# Altium schematic sheet PowerSupplies.SchDoc
size A4; SheetNumber: 5; SheetTotal: 22
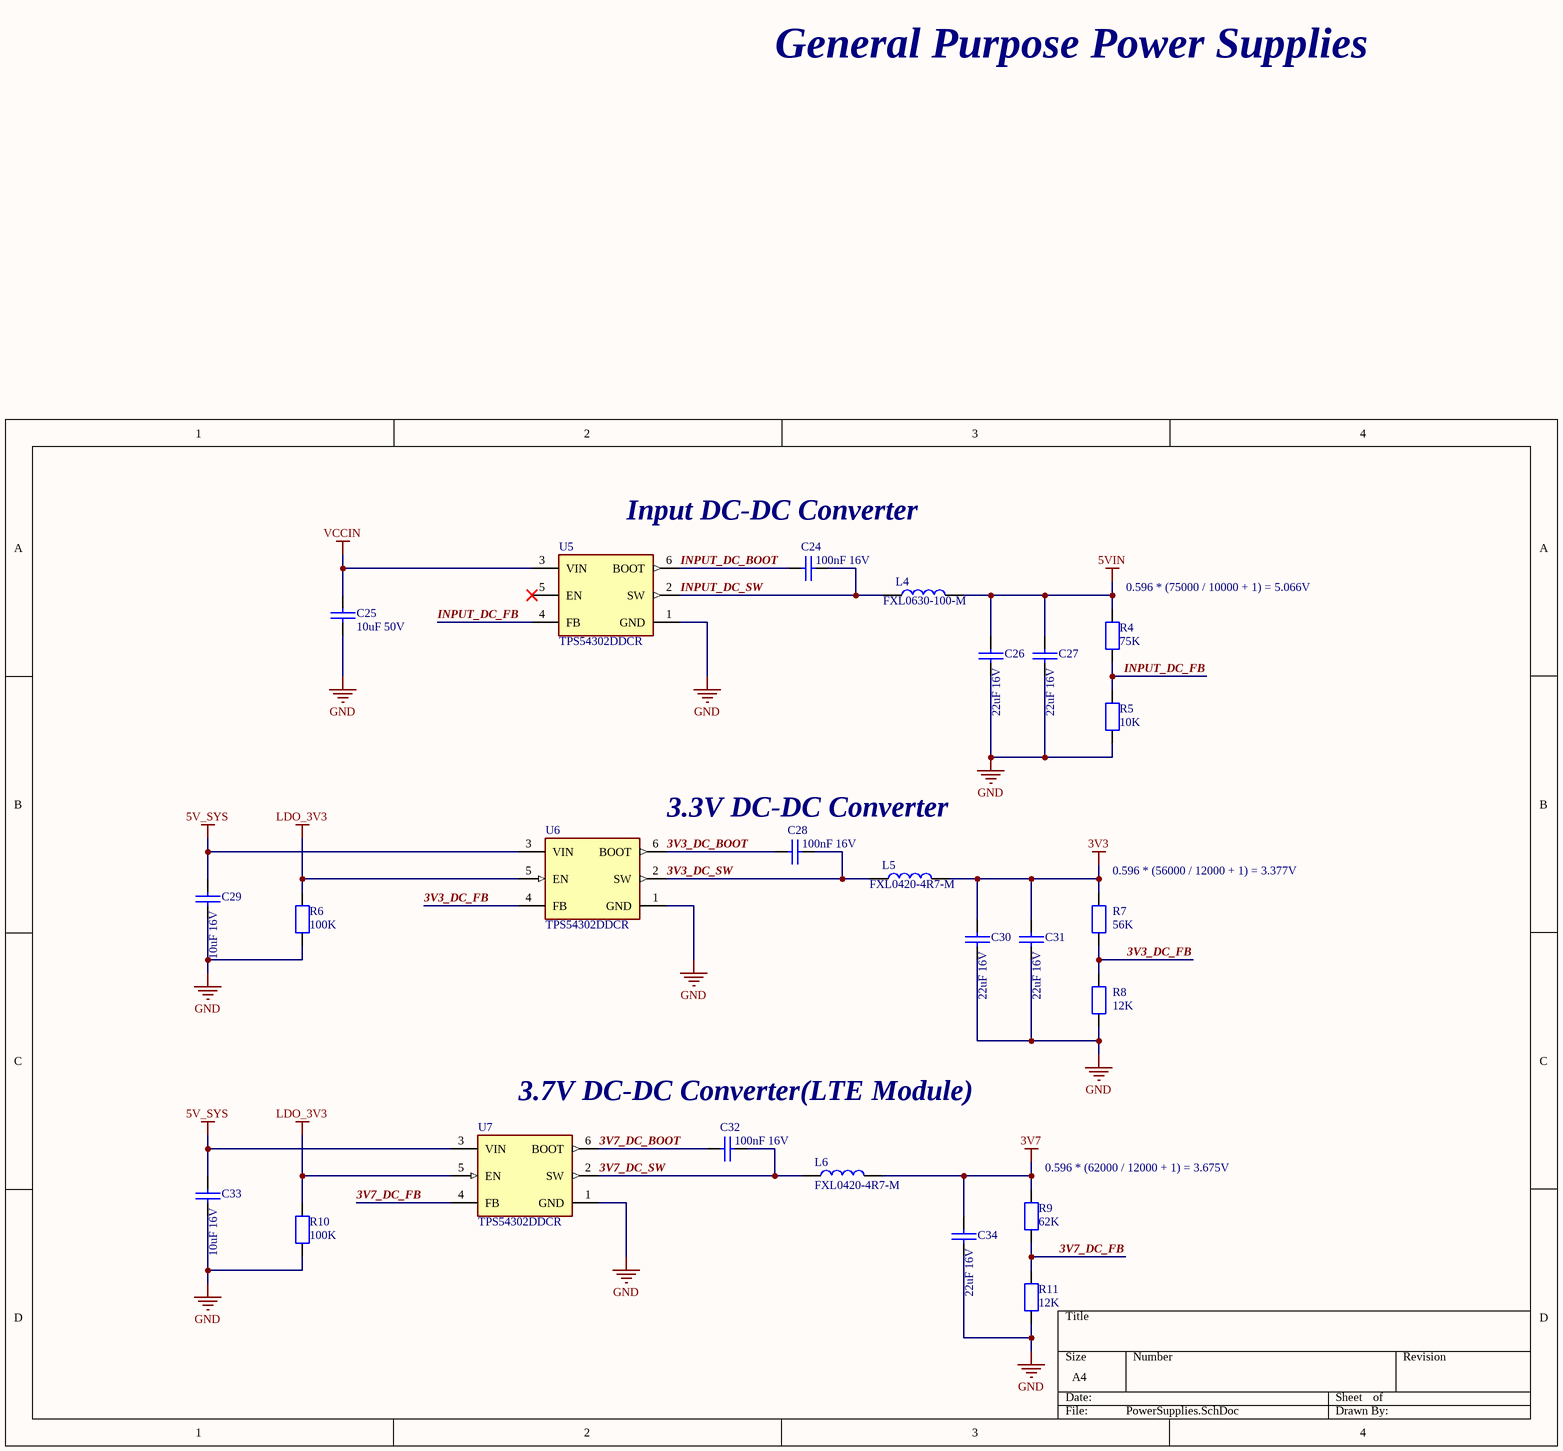
[diagram p0: PowerSupplies.SchDoc]

## Parts
C24  100nF 16V  [C_0402]
C25  10uF 50V  [C_1206]
C26  22uF 16V  [C_0603]
C27  22uF 16V  [C_0603]
C28  100nF 16V  [C_0402]
C29  10uF 16V  [C_0603]
C30  22uF 16V  [C_0603]
C31  22uF 16V  [C_0603]
C32  100nF 16V  [C_0402]
C33  10uF 16V  [C_0603]
C34  22uF 16V  [C_0603]
L4  FXL0630-100-M  [FXL0630]
L5  FXL0420-4R7-M  [FXL0420]
L6  FXL0420-4R7-M  [FXL0420]
R4  75K  [R_0603]
R5  10K  [R_0603]
R6  100K  [R_0603]
R7  56K  [R_0603]
R8  12K  [R_0603]
R9  62K  [R_0603]
R10  100K  [R_0603]
R11  12K  [R_0603]
U5  TPS54302DDCR  [FP-DDC0006A-MFG]
U6  TPS54302DDCR  [FP-DDC0006A-MFG]
U7  TPS54302DDCR  [FP-DDC0006A-MFG]

## Nets
3V3: C30.1 C31.1 L5.2 R7.2
3V7: C34.1 L6.2 R9.2
5V_SYS: C29.1 C33.1 U6.3(VIN) U7.3(VIN)
5VIN: C26.1 C27.1 L4.2 R4.2
GND: C25.2 C26.2 C27.2 C29.2 C30.2 C31.2 C33.2 C34.2 R5.1 R6.1 R8.1 R10.1 R11.1 U5.1(GND) U6.1(GND) U7.1(GND)
LDO_3V3: R6.2 R10.2 U6.5(EN) U7.5(EN)
VCCIN: C25.1 U5.3(VIN)
3V3_DC_BOOT: C28.1 U6.6(BOOT)
3V3_DC_FB: R7.1 R8.2 U6.4(FB)
3V3_DC_SW: C28.2 L5.1 U6.2(SW)
3V7_DC_BOOT: C32.1 U7.6(BOOT)
3V7_DC_FB: R9.1 R11.2 U7.4(FB)
3V7_DC_SW: C32.2 L6.1 U7.2(SW)
INPUT_DC_BOOT: C24.1 U5.6(BOOT)
INPUT_DC_FB: R4.1 R5.2 U5.4(FB)
INPUT_DC_SW: C24.2 L4.1 U5.2(SW)

Not connected (* = marked no-connect by the designer): U5 5(EN)*

## Notes on the sheet
- General Purpose Power Supplies
- Input DC-DC Converter
- (near R4) 0.596 * (75000 / 10000 + 1) = 5.066V
- 3.3V DC-DC Converter
- (near R7) 0.596 * (56000 / 12000 + 1) = 3.377V
- 3.7V DC-DC Converter(LTE Module)
- (near R9) 0.596 * (62000 / 12000 + 1) = 3.675V

## Library data of the parts
C24 C28 C32 = C_0402: Capacitor 0402 SMD
C25 = C_1206: Capacitor 1206 SMD
C26 C27 C29-C31 C33 C34 = C_0603: Capacitor 0603 SMD
L4 = FXL0630-100-M: 4.5A 10uH Winding Inductor ±20% 5.5A SMD,6.6x7mm Power Inductors ROHS; Manufacturer: cjiang; Manufacturer Part Number: FXL0630-150-M; Datasheet Link: https://www.lcsc.com/datasheet/lcsc_datasheet_2404260921_cjiang--Changjiang-Microelectronics-Tech-FXL0630-150-M_C177243.pdf
L5 L6 = FXL0420-4R7-M: 2.8A 4.7uH Winding Inductor ±20% 3A SMD,4.2x4.4mm Power Inductors ROHS; Manufacturer: cjiang (Changjiang Microelectronics Tech); Mfr. Part: FXL0420-100-M; Datasheet: https://www.lcsc.com/datasheet/lcsc_datasheet_2404260921_cjiang--Changjiang-Microelectronics-Tech-FXL0420-100-M_C177242.pdf
R4-R11 = R_0603: Resistor 0603 SMD
U5-U7 = CMP-04918-000032-1: IC REG BUCK ADJ 3A TSOT23-6; Manufacturer: Texas Instruments; Output Voltage: 0.6-26V; Output Type: AdjustableProgrammable; Max Junction Temp: +125°C; Number Of Outputs: 1; Min Supply Voltage: 4.5V; Switching Frequency: 400kHz; Standoff Height: 0mm; Max Duty Cycle: 100%; Nominal Supply Current: 45uA; Max Supply Voltage: 28V; Temperature Range High: +125°C; Switching Topology: Buck; Device Class L2: Power Management ICs; Output Current: 3A; Automotive: No; Temperature Range Low: -40°C; Temperature: -40°C to +125°C; Height: 1.1mm; Ipc Land Pattern Name: SOT95P280X110-6; RoHS: TRUE; Digikey Description: IC REG BUCK ADJ 3A TSOT23-6; Manufacturer Part Number: TPS54302DDCR; ComponentLink2Description: Datasheet; Device Class L3: Voltage Regulators - Switching; Octopart: https://octopart.com/tps54302ddcr-texas+instruments-74209025; Device Class L1: Integrated Circuits (ICs); Lead Free: Yes; ComponentLink2URL: http://www.ti.com/lit/ds/symlink/tps54302.pdf; Category: IC; Package: DDC0006A